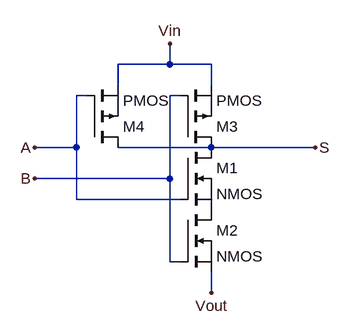
[diagram p0: schematic NAND.asc]
NAND.asc, the LTspice schematic file:
Version 4
SHEET 1 880 680
WIRE 208 -16 208 -48
WIRE 208 -16 128 -16
WIRE 272 -16 208 -16
WIRE 128 16 128 -16
WIRE 272 16 272 -16
WIRE 80 32 64 32
WIRE 224 32 208 32
WIRE 64 112 64 32
WIRE 64 112 0 112
WIRE 272 112 128 112
WIRE 432 112 272 112
WIRE 208 160 208 32
WIRE 208 160 0 160
WIRE 64 192 64 112
WIRE 224 192 64 192
WIRE 208 288 208 160
WIRE 224 288 208 288
WIRE 272 336 272 304
FLAG 0 112 A
FLAG 0 160 B
FLAG 208 -48 Vin
FLAG 272 336 Vout
FLAG 432 112 S
SYMBOL nmos 224 112 R0
SYMATTR InstName M1
SYMBOL nmos 224 208 R0
SYMATTR InstName M2
SYMBOL pmos 224 112 M180
SYMATTR InstName M3
SYMBOL pmos 80 112 M180
SYMATTR InstName M4

The netlist it stands for:
* NAND.asc
M1 S A P001 P001 NMOS
M2 P001 B Vout Vout NMOS
M3 S B Vin Vin PMOS
M4 S A Vin Vin PMOS
.model NMOS NMOS
.model PMOS PMOS
.lib standard.mos
.backanno
.end